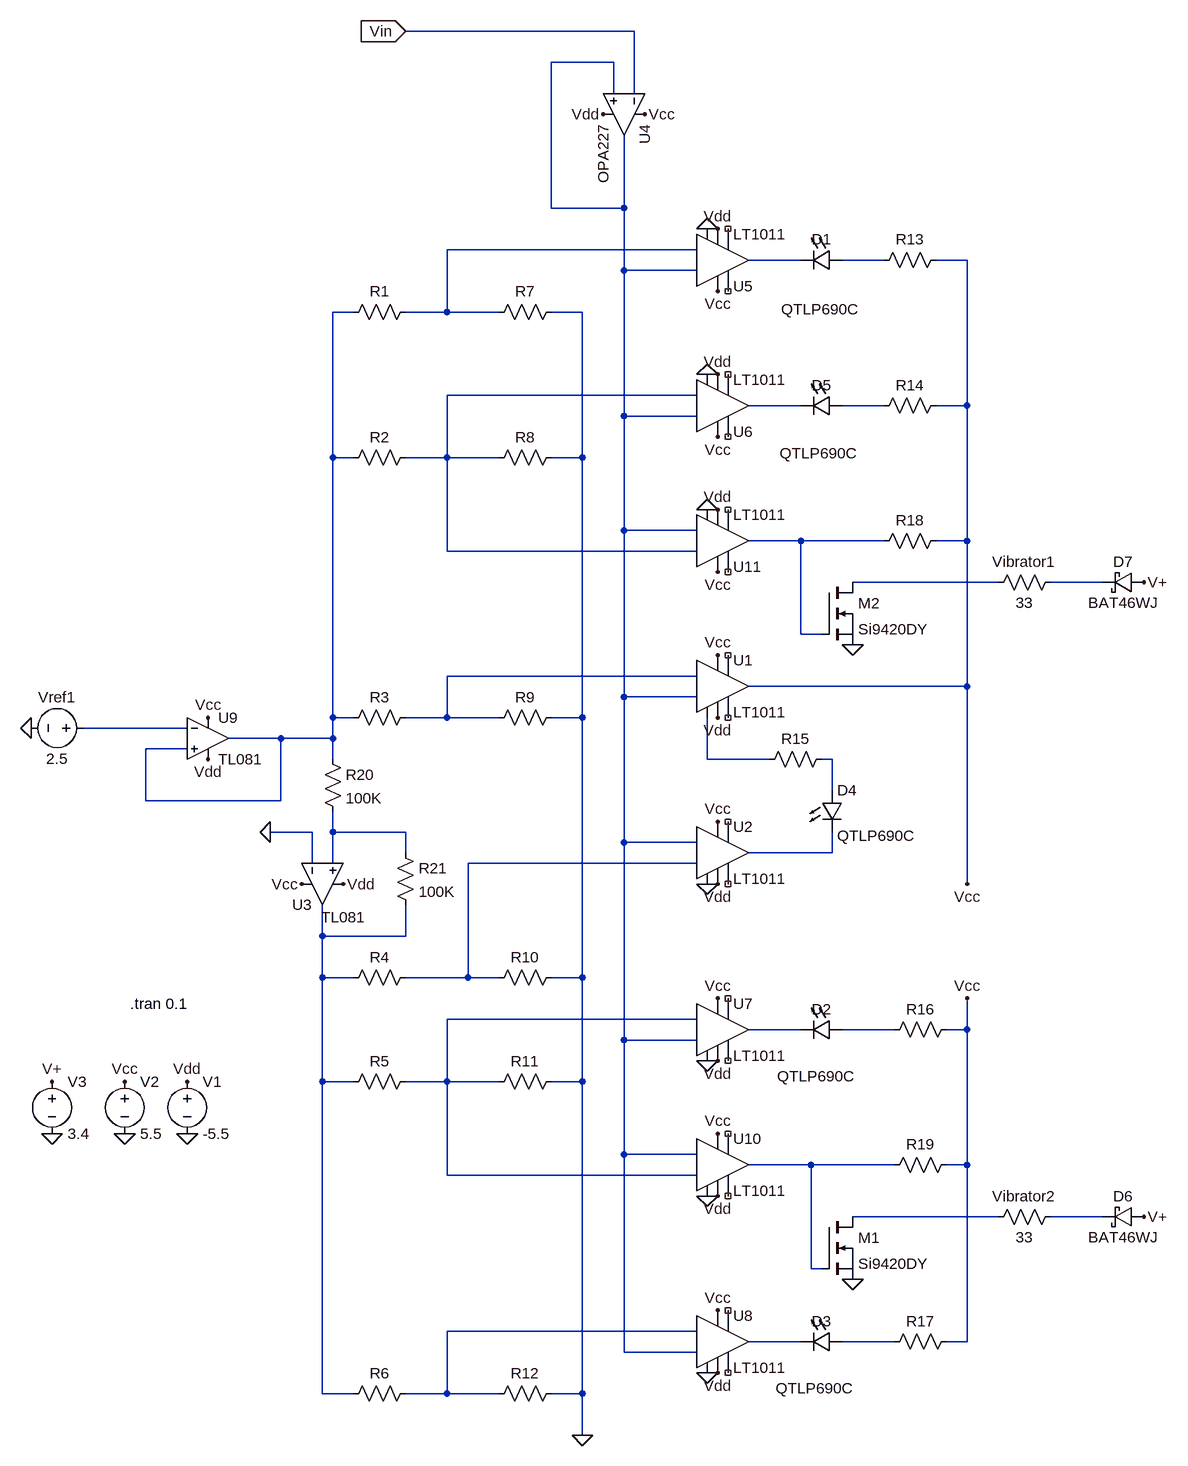
[diagram p0: schematic KomparatorUVærdi.asc]
KomparatorUVærdi.asc, the LTspice schematic file:
Version 4
SHEET 1 880 680
WIRE -496 -1968 -848 -1968
WIRE -528 -1920 -624 -1920
WIRE -528 -1872 -528 -1920
WIRE -496 -1872 -496 -1968
WIRE -624 -1696 -624 -1920
WIRE -512 -1696 -512 -1808
WIRE -512 -1696 -624 -1696
WIRE -400 -1632 -784 -1632
WIRE -240 -1616 -320 -1616
WIRE -112 -1616 -176 -1616
WIRE 16 -1616 -32 -1616
WIRE -512 -1600 -512 -1696
WIRE -400 -1600 -512 -1600
WIRE -928 -1536 -960 -1536
WIRE -784 -1536 -784 -1632
WIRE -784 -1536 -848 -1536
WIRE -704 -1536 -784 -1536
WIRE -576 -1536 -624 -1536
WIRE -400 -1408 -784 -1408
WIRE -240 -1392 -320 -1392
WIRE -112 -1392 -176 -1392
WIRE 16 -1392 16 -1616
WIRE 16 -1392 -32 -1392
WIRE -512 -1376 -512 -1600
WIRE -400 -1376 -512 -1376
WIRE -960 -1312 -960 -1536
WIRE -928 -1312 -960 -1312
WIRE -784 -1312 -784 -1408
WIRE -784 -1312 -848 -1312
WIRE -704 -1312 -784 -1312
WIRE -576 -1312 -576 -1536
WIRE -576 -1312 -624 -1312
WIRE -512 -1200 -512 -1376
WIRE -400 -1200 -512 -1200
WIRE -240 -1184 -320 -1184
WIRE -112 -1184 -240 -1184
WIRE 16 -1184 16 -1392
WIRE 16 -1184 -32 -1184
WIRE -784 -1168 -784 -1312
WIRE -400 -1168 -784 -1168
WIRE 64 -1120 -160 -1120
WIRE 224 -1120 144 -1120
WIRE -240 -1040 -240 -1184
WIRE -208 -1040 -240 -1040
WIRE -400 -976 -784 -976
WIRE 16 -960 16 -1184
WIRE 16 -960 -320 -960
WIRE -512 -944 -512 -1200
WIRE -400 -944 -512 -944
WIRE -960 -912 -960 -1312
WIRE -928 -912 -960 -912
WIRE -784 -912 -784 -976
WIRE -784 -912 -848 -912
WIRE -704 -912 -784 -912
WIRE -576 -912 -576 -1312
WIRE -576 -912 -624 -912
WIRE -1184 -896 -1344 -896
WIRE -1040 -880 -1120 -880
WIRE -960 -880 -960 -912
WIRE -960 -880 -1040 -880
WIRE -1184 -864 -1248 -864
WIRE -960 -848 -960 -880
WIRE -384 -848 -384 -912
WIRE -288 -848 -384 -848
WIRE -192 -848 -208 -848
WIRE -192 -800 -192 -848
WIRE -1248 -784 -1248 -864
WIRE -1040 -784 -1040 -880
WIRE -1040 -784 -1248 -784
WIRE -992 -736 -1056 -736
WIRE -960 -736 -960 -768
WIRE -848 -736 -960 -736
WIRE -512 -720 -512 -944
WIRE -400 -720 -512 -720
WIRE -848 -704 -848 -736
WIRE -192 -704 -192 -736
WIRE -192 -704 -320 -704
WIRE -992 -688 -992 -736
WIRE -960 -688 -960 -736
WIRE -400 -688 -752 -688
WIRE 16 -656 16 -960
WIRE -976 -576 -976 -624
WIRE -848 -576 -848 -624
WIRE -848 -576 -976 -576
WIRE -976 -512 -976 -576
WIRE -928 -512 -976 -512
WIRE -752 -512 -752 -688
WIRE -752 -512 -848 -512
WIRE -704 -512 -752 -512
WIRE -576 -512 -576 -912
WIRE -576 -512 -624 -512
WIRE -400 -448 -784 -448
WIRE -240 -432 -320 -432
WIRE -96 -432 -176 -432
WIRE 16 -432 16 -480
WIRE 16 -432 -16 -432
WIRE -512 -416 -512 -720
WIRE -400 -416 -512 -416
WIRE -976 -352 -976 -512
WIRE -928 -352 -976 -352
WIRE -784 -352 -784 -448
WIRE -784 -352 -848 -352
WIRE -704 -352 -784 -352
WIRE -576 -352 -576 -512
WIRE -576 -352 -624 -352
WIRE -512 -240 -512 -416
WIRE -400 -240 -512 -240
WIRE -224 -224 -320 -224
WIRE -96 -224 -224 -224
WIRE 16 -224 16 -432
WIRE 16 -224 -16 -224
WIRE -784 -208 -784 -352
WIRE -400 -208 -784 -208
WIRE 64 -144 -160 -144
WIRE 224 -144 144 -144
WIRE -224 -64 -224 -224
WIRE -208 -64 -224 -64
WIRE -400 32 -784 32
WIRE -240 48 -320 48
WIRE -96 48 -176 48
WIRE 16 48 16 -224
WIRE 16 48 -16 48
WIRE -512 64 -512 -240
WIRE -400 64 -512 64
WIRE -976 128 -976 -352
WIRE -928 128 -976 128
WIRE -784 128 -784 32
WIRE -784 128 -848 128
WIRE -704 128 -784 128
WIRE -576 128 -576 -352
WIRE -576 128 -624 128
WIRE -576 192 -576 128
FLAG -384 -656 0
FLAG 16 -656 Vcc
FLAG 16 -480 Vcc
FLAG -368 -1008 Vcc
FLAG -368 -752 Vcc
FLAG -368 -656 Vdd
FLAG -576 192 0
FLAG -1280 -352 Vcc
FLAG -1424 -896 0
FLAG -1056 -736 0
FLAG -1280 -272 0
FLAG -1184 -272 0
FLAG -1184 -352 Vdd
FLAG -368 -912 Vdd
FLAG -480 -1840 Vcc
FLAG -1008 -656 Vcc
FLAG -944 -656 Vdd
FLAG -544 -1840 Vdd
FLAG -384 -1664 0
FLAG -384 -1440 0
FLAG -368 -1344 Vcc
FLAG -368 -1568 Vcc
FLAG -368 -1664 Vdd
FLAG -368 -1440 Vdd
FLAG -368 0 Vcc
FLAG -368 -480 Vcc
FLAG -368 -384 Vdd
FLAG -368 96 Vdd
FLAG -384 -384 0
FLAG -384 96 0
FLAG -1152 -912 Vcc
FLAG -1152 -848 Vdd
FLAG -384 -176 0
FLAG -368 -176 Vdd
FLAG -368 -272 Vcc
FLAG -160 -48 0
FLAG -1392 -272 0
FLAG -1392 -352 V+
FLAG 288 -144 V+
FLAG -160 -1024 0
FLAG -384 -1232 0
FLAG 288 -1120 V+
FLAG -368 -1136 Vcc
FLAG -368 -1232 Vdd
FLAG -848 -1968 Vin
IOPIN -848 -1968 In
SYMBOL LED -176 -1632 R90
WINDOW 0 0 32 VBottom 2
WINDOW 3 107 34 VBottom 2
SYMATTR InstName D1
SYMATTR Value QTLP690C
SYMATTR Description Diode
SYMATTR Type diode
SYMBOL res -608 -1552 R90
WINDOW 0 0 56 VBottom 2
WINDOW 3 32 56 VTop 2
SYMATTR InstName R7
SYMATTR Value ""
SYMBOL res -832 -1552 R90
WINDOW 0 0 56 VBottom 2
WINDOW 3 32 56 VTop 2
SYMATTR InstName R1
SYMATTR Value ""
SYMBOL res -16 -1632 R90
WINDOW 0 0 56 VBottom 2
WINDOW 3 32 56 VTop 2
SYMATTR InstName R13
SYMATTR Value ""
SYMBOL res -608 -1328 R90
WINDOW 0 0 56 VBottom 2
WINDOW 3 32 56 VTop 2
SYMATTR InstName R8
SYMATTR Value ""
SYMBOL res -832 -1328 R90
WINDOW 0 0 56 VBottom 2
WINDOW 3 32 56 VTop 2
SYMATTR InstName R2
SYMATTR Value ""
SYMBOL res -16 -1408 R90
WINDOW 0 0 56 VBottom 2
WINDOW 3 32 56 VTop 2
SYMATTR InstName R14
SYMATTR Value ""
SYMBOL Comparators/LT1011 -368 -960 R0
SYMATTR InstName U1
SYMBOL Comparators/LT1011 -368 -704 R0
SYMATTR InstName U2
SYMBOL res -832 -928 R90
WINDOW 0 0 56 VBottom 2
WINDOW 3 32 56 VTop 2
SYMATTR InstName R3
SYMATTR Value ""
SYMBOL res -608 -928 R90
WINDOW 0 0 56 VBottom 2
WINDOW 3 32 56 VTop 2
SYMATTR InstName R9
SYMATTR Value ""
SYMBOL res -976 -864 R0
SYMATTR InstName R20
SYMATTR Value 100K
SYMBOL res -864 -720 R0
SYMATTR InstName R21
SYMATTR Value 100K
SYMBOL res -832 -368 R90
WINDOW 0 0 56 VBottom 2
WINDOW 3 32 56 VTop 2
SYMATTR InstName R5
SYMATTR Value ""
SYMBOL res -608 -368 R90
WINDOW 0 0 56 VBottom 2
WINDOW 3 32 56 VTop 2
SYMATTR InstName R11
SYMATTR Value ""
SYMBOL res -832 112 R90
WINDOW 0 0 56 VBottom 2
WINDOW 3 32 56 VTop 2
SYMATTR InstName R6
SYMATTR Value ""
SYMBOL res -608 112 R90
WINDOW 0 0 56 VBottom 2
WINDOW 3 32 56 VTop 2
SYMATTR InstName R12
SYMATTR Value ""
SYMBOL LED -176 -448 R90
WINDOW 0 0 32 VBottom 2
WINDOW 3 103 40 VBottom 2
SYMATTR InstName D2
SYMATTR Value QTLP690C
SYMATTR Description Diode
SYMATTR Type diode
SYMBOL LED -176 32 R90
WINDOW 0 0 32 VBottom 2
WINDOW 3 103 42 VBottom 2
SYMATTR InstName D3
SYMATTR Value QTLP690C
SYMATTR Description Diode
SYMATTR Type diode
SYMBOL res 0 -448 R90
WINDOW 0 0 56 VBottom 2
WINDOW 3 32 56 VTop 2
SYMATTR InstName R16
SYMATTR Value ""
SYMBOL res 0 32 R90
WINDOW 0 0 56 VBottom 2
WINDOW 3 32 56 VTop 2
SYMATTR InstName R17
SYMATTR Value ""
SYMBOL voltage -1328 -896 R90
WINDOW 0 -32 56 VBottom 2
WINDOW 3 32 56 VTop 2
SYMATTR InstName Vref1
SYMATTR Value 2.5
SYMBOL voltage -1184 -368 R0
SYMATTR InstName V1
SYMATTR Value -5.5
SYMBOL voltage -1280 -368 R0
SYMATTR InstName V2
SYMATTR Value 5.5
SYMBOL res -192 -864 R90
WINDOW 0 0 56 VBottom 2
WINDOW 3 32 56 VTop 2
SYMATTR InstName R15
SYMATTR Value ""
SYMBOL Opamps\\TL081 -1040 -656 M90
WINDOW 0 32 48 VLeft 2
WINDOW 3 51 131 VLeft 2
SYMATTR InstName U3
SYMBOL Opamps\\OPA227 -448 -1840 R90
SYMATTR InstName U4
SYMBOL LED -208 -800 R0
WINDOW 3 24 70 Left 2
SYMATTR Value QTLP690C
SYMATTR InstName D4
SYMATTR Description Diode
SYMATTR Type diode
SYMBOL Comparators\\LT1011 -368 -1616 M180
SYMATTR InstName U5
SYMBOL Comparators\\LT1011 -368 -1392 M180
SYMATTR InstName U6
SYMBOL Comparators\\LT1011 -368 -432 R0
SYMATTR InstName U7
SYMBOL Comparators\\LT1011 -368 48 R0
SYMATTR InstName U8
SYMBOL res -832 -528 R90
WINDOW 0 0 56 VBottom 2
WINDOW 3 32 56 VTop 2
SYMATTR InstName R4
SYMATTR Value ""
SYMBOL res -608 -528 R90
WINDOW 0 0 56 VBottom 2
WINDOW 3 32 56 VTop 2
SYMATTR InstName R10
SYMATTR Value ""
SYMBOL LED -176 -1408 R90
WINDOW 0 0 32 VBottom 2
WINDOW 3 105 36 VBottom 2
SYMATTR InstName D5
SYMATTR Value QTLP690C
SYMATTR Description Diode
SYMATTR Type diode
SYMBOL Opamps\\TL081 -1152 -944 R0
SYMATTR InstName U9
SYMBOL Comparators\\LT1011 -368 -224 R0
SYMATTR InstName U10
SYMBOL res 0 -240 R90
WINDOW 0 0 56 VBottom 2
WINDOW 3 32 56 VTop 2
SYMATTR InstName R19
SYMATTR Value ""
SYMBOL nmos -208 -144 R0
SYMATTR InstName M1
SYMATTR Value Si9420DY
SYMBOL schottky 288 -160 R90
WINDOW 0 0 32 VBottom 2
WINDOW 3 32 32 VTop 2
SYMATTR InstName D6
SYMATTR Value BAT46WJ
SYMATTR Description Diode
SYMATTR Type diode
SYMBOL voltage -1392 -368 R0
WINDOW 123 0 0 Left 2
WINDOW 39 0 0 Left 2
SYMATTR InstName V3
SYMATTR Value 3.4
SYMBOL res -16 -1200 R90
WINDOW 0 0 56 VBottom 2
WINDOW 3 32 56 VTop 2
SYMATTR InstName R18
SYMATTR Value ""
SYMBOL Comparators\\LT1011 -368 -1184 M180
SYMATTR InstName U11
SYMBOL nmos -208 -1120 R0
SYMATTR InstName M2
SYMATTR Value Si9420DY
SYMBOL schottky 288 -1136 R90
WINDOW 0 0 32 VBottom 2
WINDOW 3 32 32 VTop 2
SYMATTR InstName D7
SYMATTR Value BAT46WJ
SYMATTR Description Diode
SYMATTR Type diode
SYMBOL res 160 -1136 R90
WINDOW 0 0 56 VBottom 2
WINDOW 3 32 56 VTop 2
SYMATTR InstName Vibrator1
SYMATTR Value 33
SYMBOL res 160 -160 R90
WINDOW 0 0 56 VBottom 2
WINDOW 3 32 56 VTop 2
SYMATTR InstName Vibrator2
SYMATTR Value 33
TEXT -1272 -472 Left 2 !.tran 0.1

The netlist it stands for:
* KomparatorUVærdi.asc
D1 N004 N003 QTLP690C
R7 0 N002
R1 N002 N005
R13 Vcc N004
R8 0 N006
R2 N006 N005
R14 Vcc N008
XU1 N014 N001 N012 Vdd NC_01 NC_02 Vcc Vcc LT1011
XU2 0 N018 N001 Vdd NC_03 NC_04 N017 Vcc LT1011
R3 N012 N005
R9 0 N012
R20 N005 N016 100K
R21 N016 N019 100K
R5 N020 N019
R11 0 N020
R6 N026 N019
R12 0 N026
D2 N022 N021 QTLP690C
D3 N028 N027 QTLP690C
R16 Vcc N022
R17 Vcc N028
Vref1 N013 0 2.5
V1 Vdd 0 -5.5
V2 Vcc 0 5.5
R15 N015 N014
XU3 N016 0 Vcc Vdd N019 TL081  ; pins In+ In- V+ V- OUT
XU4 N001 Vin Vcc Vdd N001 OPA227  ; pins In+ In- V+ V- OUT
D4 N015 N017 QTLP690C
XU5 0 N002 N001 Vdd NC_05 NC_06 N003 Vcc LT1011
XU6 0 N006 N001 Vdd NC_07 NC_08 N007 Vcc LT1011
XU7 0 N001 N020 Vdd NC_09 NC_10 N021 Vcc LT1011
XU8 0 N001 N026 Vdd NC_11 NC_12 N027 Vcc LT1011
R4 N018 N019
R10 0 N018
D5 N008 N007 QTLP690C
XU9 N005 N013 Vcc Vdd N005 TL081  ; pins In+ In- V+ V- OUT
XU10 0 N020 N001 Vdd NC_13 NC_14 N023 Vcc LT1011
R19 Vcc N023
M1 N024 N023 0 0 Si9420DY
D6 V+ N025 BAT46WJ
V3 V+ 0 3.4
R18 Vcc N009
XU11 0 N001 N006 Vdd NC_15 NC_16 N009 Vcc LT1011
M2 N010 N009 0 0 Si9420DY
D7 V+ N011 BAT46WJ
R§Vibrator1 N011 N010 33
R§Vibrator2 N025 N024 33
.model D D
.lib standard.dio
.model NMOS NMOS
.model PMOS PMOS
.lib standard.mos
.tran 0.1
.lib LTC1.lib
.backanno
.end